# Altium schematic sheet Mcu.SchDoc
size A
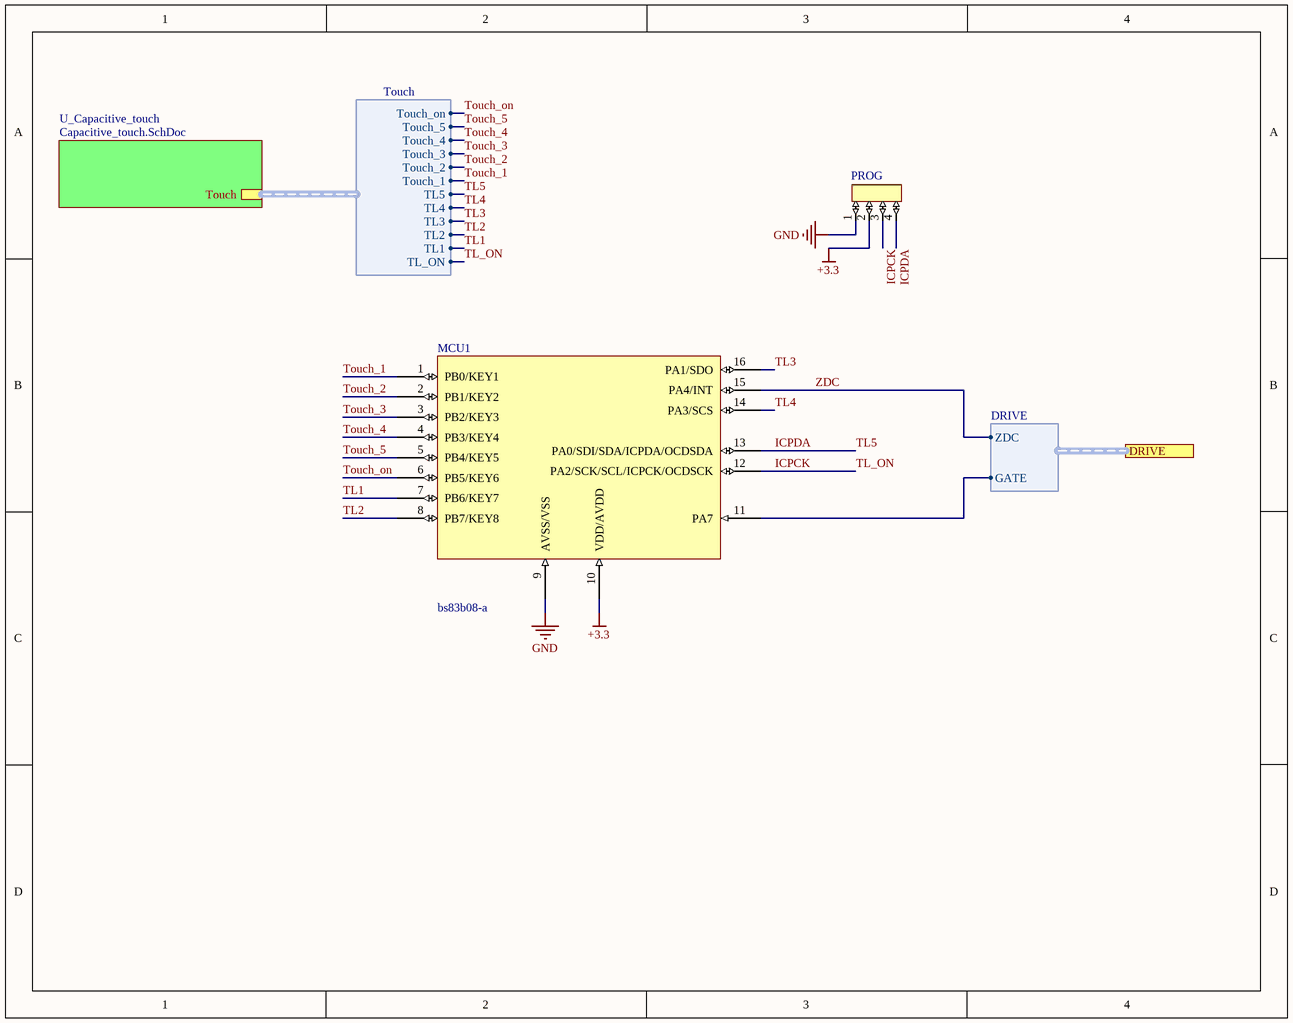
[diagram p0: Mcu.SchDoc]

## Parts
MCU1  bs83b08-a  [bs83b08-a]
PROG  (no value)  [CONECTOR/XH/4PIN]

## Sub-sheets
U_Capacitive_touch = Capacitive_touch.SchDoc: Touch (harness Touch)

## Ports
DRIVE (harness DRIVE)

## Harnesses
Touch: TL_ON, TL1, TL2, TL3, TL4, TL5, Touch_1, Touch_2, Touch_3, Touch_4, Touch_5, Touch_on
DRIVE: GATE, ZDC

## Nets
+3.3: MCU1.10(VDD/AVDD) PROG.2
GND: MCU1.9(AVSS/VSS) PROG.1
ICPCK: MCU1.12(PA2/SCK/SCL/ICPCK/OCDSCK) PROG.3 ; sheet U_Capacitive_touch/Touch.TL_ON  [also labelled TL_ON]
ICPDA: MCU1.13(PA0/SDI/SDA/ICPDA/OCDSDA) PROG.4 ; sheet U_Capacitive_touch/Touch.TL5  [also labelled TL5]
TL1: MCU1.7(PB6/KEY7) ; sheet U_Capacitive_touch/Touch.TL1
TL2: MCU1.8(PB7/KEY8) ; sheet U_Capacitive_touch/Touch.TL2
TL3: MCU1.16(PA1/SDO) ; sheet U_Capacitive_touch/Touch.TL3
TL4: MCU1.14(PA3/SCS) ; sheet U_Capacitive_touch/Touch.TL4
Touch_1: MCU1.1(PB0/KEY1) ; sheet U_Capacitive_touch/Touch.Touch_1
Touch_2: MCU1.2(PB1/KEY2) ; sheet U_Capacitive_touch/Touch.Touch_2
Touch_3: MCU1.3(PB2/KEY3) ; sheet U_Capacitive_touch/Touch.Touch_3
Touch_4: MCU1.4(PB3/KEY4) ; sheet U_Capacitive_touch/Touch.Touch_4
Touch_5: MCU1.5(PB4/KEY5) ; sheet U_Capacitive_touch/Touch.Touch_5
Touch_on: MCU1.6(PB5/KEY6) ; sheet U_Capacitive_touch/Touch.Touch_on
ZDC: MCU1.15(PA4/INT) ; port DRIVE.ZDC
NetMCU1_11: MCU1.11(PA7) ; port DRIVE.GATE

## Library data of the parts
PROG = CONECTOR/XH/4PIN